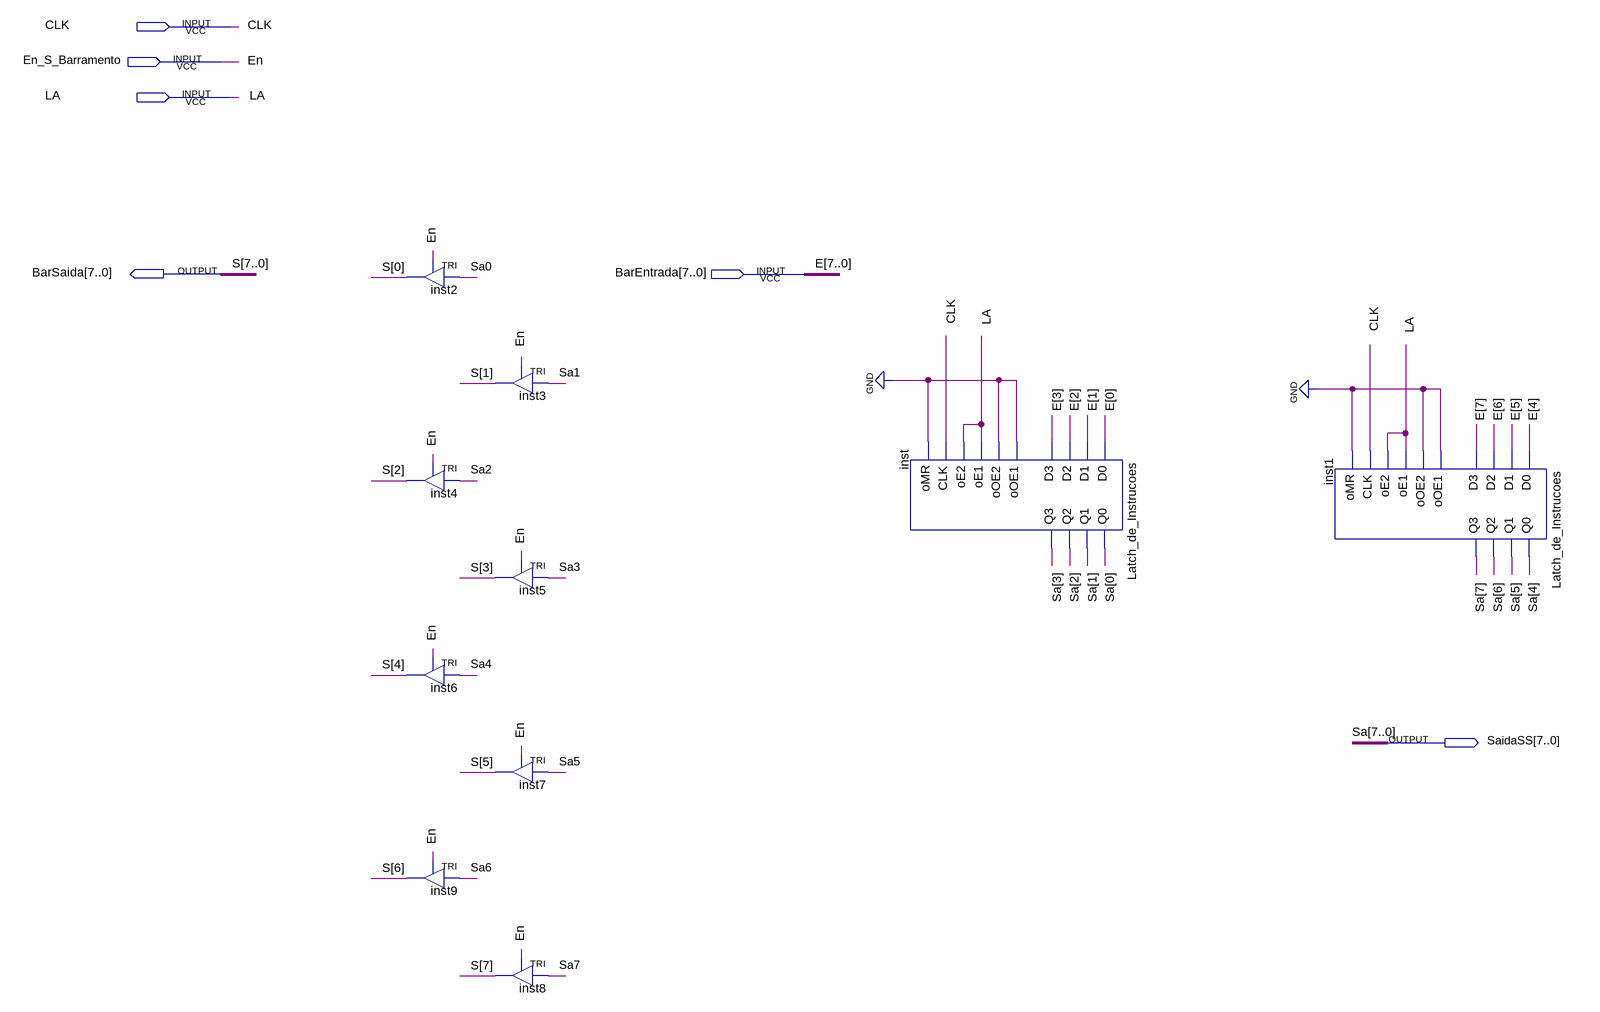
[diagram p0: schematic sheet]
// Quartus schematic Acumulador.bdf as structural Verilog: 10 symbols, 6 pins
module Acumulador (
  input  CLK,
  input  En_S_Barramento,
  input  LA,
  input  [7:0] BarEntrada,
  output [7:0] BarSaida,
  output [7:0] SaidaSS
);

  TRI inst2 (.IN(SaidaSS[0]), .OE(En_S_Barramento), .OUT(BarSaida[0]));
  TRI inst4 (.IN(SaidaSS[2]), .OE(En_S_Barramento), .OUT(BarSaida[2]));
  TRI inst6 (.IN(SaidaSS[4]), .OE(En_S_Barramento), .OUT(BarSaida[4]));
  TRI inst9 (.IN(SaidaSS[6]), .OE(En_S_Barramento), .OUT(BarSaida[6]));
  TRI inst3 (.IN(SaidaSS[1]), .OE(En_S_Barramento), .OUT(BarSaida[1]));
  TRI inst5 (.IN(SaidaSS[3]), .OE(En_S_Barramento), .OUT(BarSaida[3]));
  TRI inst7 (.IN(SaidaSS[5]), .OE(En_S_Barramento), .OUT(BarSaida[5]));
  TRI inst8 (.IN(SaidaSS[7]), .OE(En_S_Barramento), .OUT(BarSaida[7]));
  Latch_de_Instrucoes inst (
    .D0(BarEntrada[0]), .D1(BarEntrada[1]), .D2(BarEntrada[2]), .D3(BarEntrada[3]), .oOE1(1'b0), .oOE2(1'b0),
    .oE1(LA), .oE2(LA), .CLK(CLK), .oMR(1'b0), .Q0(SaidaSS[0]), .Q1(SaidaSS[1]), .Q2(SaidaSS[2]),
    .Q3(SaidaSS[3]));
  Latch_de_Instrucoes inst1 (
    .D0(BarEntrada[4]), .D1(BarEntrada[5]), .D2(BarEntrada[6]), .D3(BarEntrada[7]), .oOE1(1'b0), .oOE2(1'b0),
    .oE1(LA), .oE2(LA), .CLK(CLK), .oMR(1'b0), .Q0(SaidaSS[4]), .Q1(SaidaSS[5]), .Q2(SaidaSS[6]),
    .Q3(SaidaSS[7]));

  // Other names for the same wires on the sheet: E[7:0] = BarEntrada; En = En_S_Barramento; S[7:0] = BarSaida;
  //   Sa[7:0] = SaidaSS; Sa0 = SaidaSS[0]; Sa1 = SaidaSS[1]; Sa2 = SaidaSS[2]; Sa3 = SaidaSS[3]; Sa4 = SaidaSS[4];
  //   Sa5 = SaidaSS[5]; Sa6 = SaidaSS[6]; Sa7 = SaidaSS[7]
endmodule
